# EAGLE schematic mag_encoder_Rev1 (EAGLE 7.3.0)
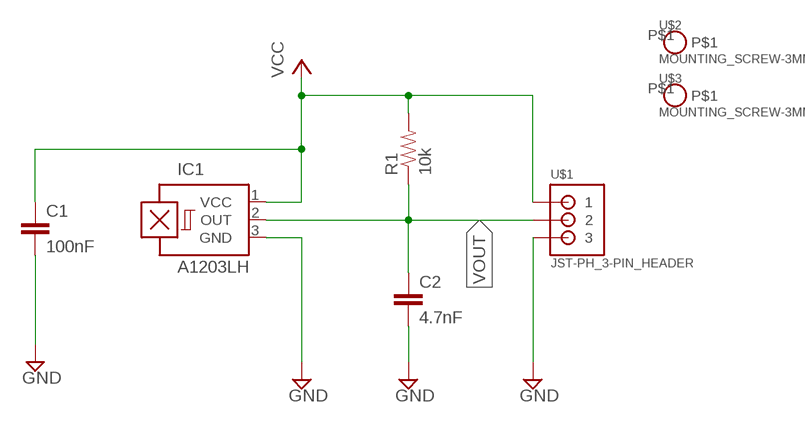
[diagram p0: schematic, sheet 1]

## Parts
C1  100nF  CAP0603-CAP  [0603-CAP]
C2  4.7nF  4.7NF-50V-10%(0603)  [0603-CAP]
IC1  A1203LH  [SOT23-W]
R1  10k  10.5KOHM1/10W1%(0603)  [0603]
U$1  JST-PH_3-PIN_HEADER  [JST_B3B-PH_HEADER]
U$2  MOUNTING_SCREW-3MM  [MOUNTING_SCREW-3MM]
U$3  MOUNTING_SCREW-3MM  [MOUNTING_SCREW-3MM]

## Nets
GND: C1.2 C2.2 IC1.3(GND) U$1.P3
VOUT: C2.1 IC1.2(OUT) R1.1 U$1.P2
WIRE: C1.1 IC1.1(VCC) R1.2 U$1.P1 ; supply symbol labelled VCC
Unconnected: U$2.P$1 U$3.P$1

## Library data of the parts
C1 = SparkFun-Capacitors:CAP: Capacitor Standard 0603 ceramic capacitor, and 0.1" leaded capacitor.
C2 = SparkFun-Capacitors:4.7NF-50V-10%(0603): CAP-11378; PROD_ID: CAP-11378
IC1 = allegro:A12*?: Hall-effect bipolar switch Source: http://www.allegromicro.com/en/Products/Part_Numbers/1202/1202.pdf; MF: ALLEGRO MICROSYSTEMS, INC.; MPN: A1203LLHLT-T; OC_FARNELL: 1791384; OC_NEWARK: 31K6608
R1 = SparkFun-Resistors:10.5KOHM1/10W1%(0603): RES-09570; PROD_ID: RES-09570; VALUE: 10.5k
U$1 = Clayton:JST-PH_3-PIN_HEADER: 3-pin JST PH Shrouded Header, top entry P/N B3B-PH-K-S Mating connector PHR-3
U$2 U$3 = Clayton:MOUNTING_SCREW-3MM